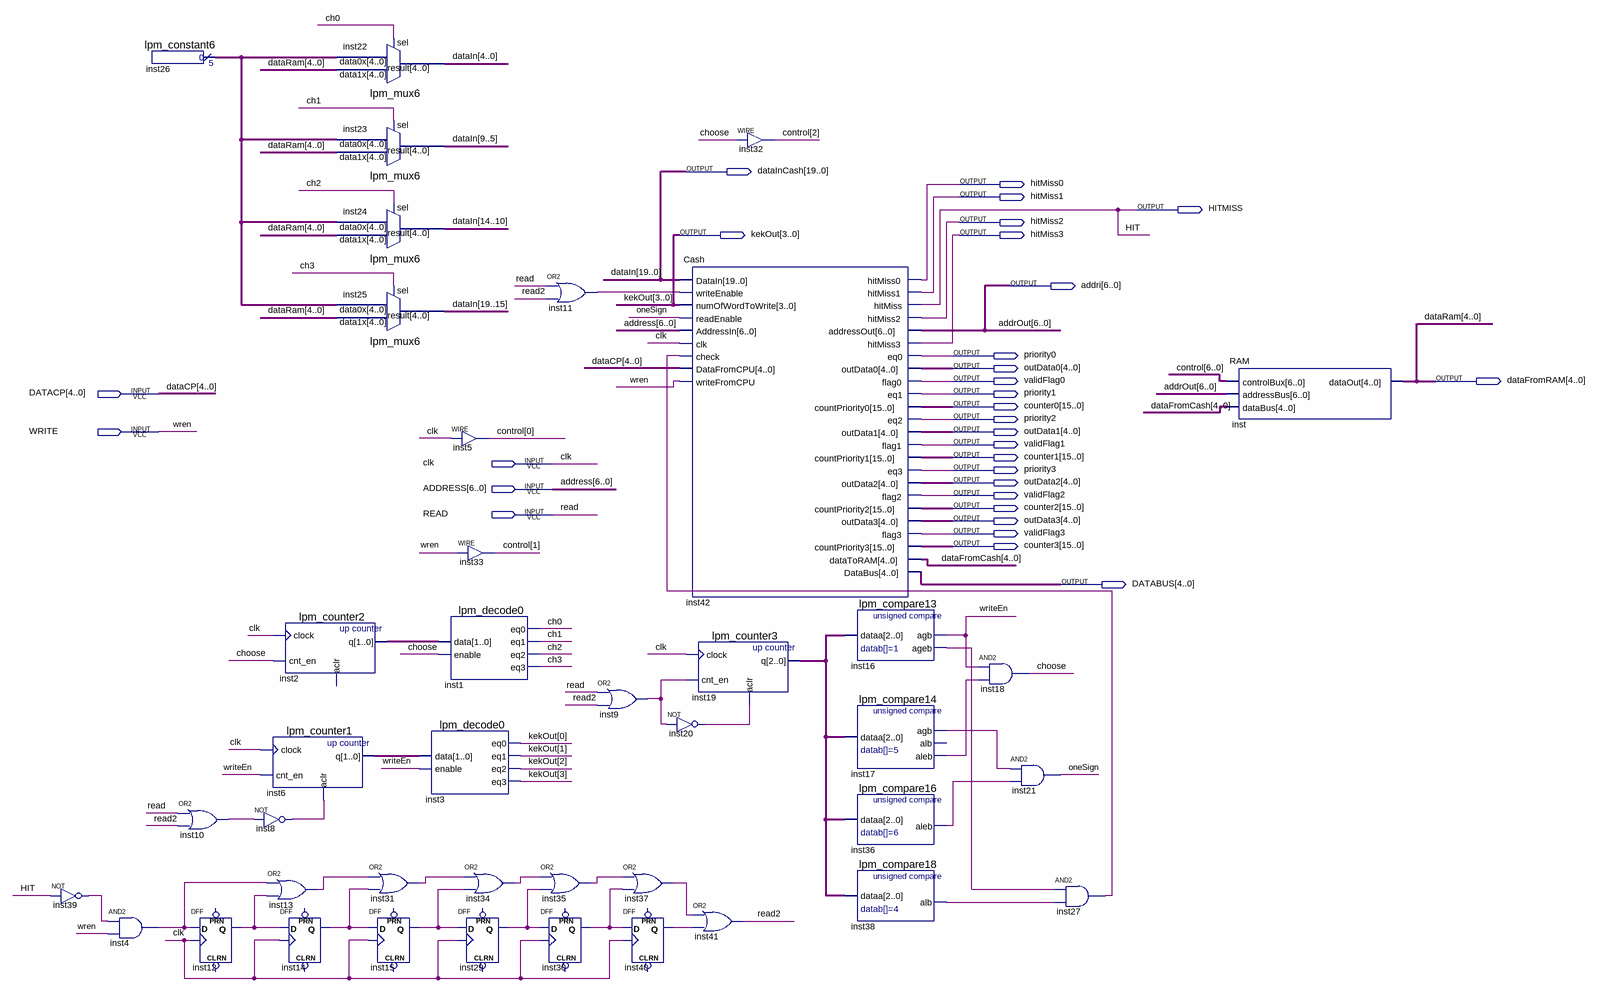
[diagram p0: schematic sheet]
// Quartus schematic laba6.bdf as structural Verilog: 41 symbols, 31 pins
module laba6 (
  input  [4:0] DATACP,
  input  WRITE,
  input  clk,
  input  [6:0] ADDRESS,
  input  READ,
  output [19:0] dataInCash,
  output hitMiss0,
  output hitMiss1,
  output HITMISS,
  output hitMiss2,
  output [3:0] kekOut,
  output hitMiss3,
  output [6:0] addri,
  output priority0,
  output [4:0] outData0,
  output validFlag0,
  output [4:0] dataFromRAM,
  output priority1,
  output [15:0] counter0,
  output priority2,
  output [4:0] outData1,
  output validFlag1,
  output [15:0] counter1,
  output priority3,
  output [4:0] outData2,
  output validFlag2,
  output [15:0] counter2,
  output [4:0] outData3,
  output validFlag3,
  output [15:0] counter3,
  output [4:0] DATABUS
);

  wire ch0, ch1, ch2, ch3, choose, inst4_out, inst8_out, inst9_out, inst10_out, inst11_out, inst12_q,
       inst13_out, inst14_q, inst15_q, inst16_ageb, inst17_agb, inst17_aleb, inst20_out, inst27_out,
       inst29_q, inst30_q, inst31_out, inst34_out, inst35_out, inst36_aleb, inst37_out, inst38_alb,
       inst39_out, inst40_q, oneSign, read2, writeEn;
  wire [1:0] inst2_q, inst6_q;
  wire [2:0] inst19_q;
  wire [4:0] dataFromCash, inst26_result;
  wire [6:0] control;

  not inst39 (inst39_out, HITMISS);
  and inst4 (inst4_out, inst39_out, WRITE);
  lpm_constant6 inst26 (.result(inst26_result));
  or inst10 (inst10_out, READ, read2);
  DFF inst12 (.CLK(clk), .D(inst4_out), .Q(inst12_q));  // open: CLRN, PRN
  lpm_counter2 inst2 (.clock(clk), .cnt_en(choose), .q(inst2_q));  // open: aclr
  lpm_counter1 inst6 (.clock(clk), .cnt_en(writeEn), .aclr(inst8_out), .q(inst6_q));
  not inst8 (inst8_out, inst10_out);
  or inst13 (inst13_out, inst4_out, inst12_q);
  DFF inst14 (.CLK(clk), .D(inst12_q), .Q(inst14_q));  // open: CLRN, PRN
  lpm_mux6 inst22 (.data1x(dataFromRAM), .data0x(inst26_result), .sel(ch0), .result(dataInCash[4:0]));
  lpm_mux6 inst23 (.data1x(dataFromRAM), .data0x(inst26_result), .sel(ch1), .result(dataInCash[9:5]));
  lpm_mux6 inst24 (.data1x(dataFromRAM), .data0x(inst26_result), .sel(ch2), .result(dataInCash[14:10]));
  lpm_mux6 inst25 (.data1x(dataFromRAM), .data0x(inst26_result), .sel(ch3), .result(dataInCash[19:15]));
  or inst31 (inst31_out, inst13_out, inst14_q);
  DFF inst15 (.CLK(clk), .D(inst14_q), .Q(inst15_q));  // open: CLRN, PRN
  lpm_decode0 inst1 (.data(inst2_q), .enable(choose), .eq0(ch0), .eq1(ch1), .eq2(ch2), .eq3(ch3));
  lpm_decode0 inst3 (
    .data(inst6_q), .enable(writeEn), .eq0(kekOut[0]), .eq1(kekOut[1]), .eq2(kekOut[2]), .eq3(kekOut[3]));
  assign control[0] = clk;  // WIRE inst5
  assign control[1] = WRITE;  // WIRE inst33
  or inst34 (inst34_out, inst31_out, inst15_q);
  DFF inst29 (.CLK(clk), .D(inst15_q), .Q(inst29_q));  // open: CLRN, PRN
  or inst35 (inst35_out, inst34_out, inst29_q);
  DFF inst30 (.CLK(clk), .D(inst29_q), .Q(inst30_q));  // open: CLRN, PRN
  or inst11 (inst11_out, READ, read2);
  or inst9 (inst9_out, READ, read2);
  or inst37 (inst37_out, inst35_out, inst30_q);
  DFF inst40 (.CLK(clk), .D(inst30_q), .Q(inst40_q));  // open: CLRN, PRN
  Cash inst42 (
    .DataIn(dataInCash), .writeEnable(inst11_out), .numOfWordToWrite(kekOut), .readEnable(oneSign),
    .AddressIn(ADDRESS), .clk(clk), .check(inst27_out), .DataFromCPU(DATACP), .writeFromCPU(WRITE),
    .hitMiss0(hitMiss0), .hitMiss1(hitMiss1), .hitMiss(HITMISS), .hitMiss2(hitMiss2), .addressOut(addri),
    .hitMiss3(hitMiss3), .eq0(priority0), .outData0(outData0), .flag0(validFlag0), .eq1(priority1),
    .countPriority0(counter0), .eq2(priority2), .outData1(outData1), .flag1(validFlag1),
    .countPriority1(counter1), .eq3(priority3), .outData2(outData2), .flag2(validFlag2),
    .countPriority2(counter2), .outData3(outData3), .flag3(validFlag3), .countPriority3(counter3),
    .dataToRAM(dataFromCash), .DataBus(DATABUS));
  lpm_counter3 inst19 (.clock(clk), .cnt_en(inst9_out), .aclr(inst20_out), .q(inst19_q));
  not inst20 (inst20_out, inst9_out);
  or inst41 (read2, inst37_out, inst40_q);
  assign control[2] = choose;  // WIRE inst32
  lpm_compare13 inst16 (.dataa(inst19_q), .agb(writeEn), .ageb(inst16_ageb));
  lpm_compare14 inst17 (.dataa(inst19_q), .agb(inst17_agb), .aleb(inst17_aleb));  // open: alb
  lpm_compare16 inst36 (.dataa(inst19_q), .aleb(inst36_aleb));
  lpm_compare18 inst38 (.dataa(inst19_q), .alb(inst38_alb));
  and inst18 (choose, writeEn, inst17_aleb);
  and inst21 (oneSign, inst17_agb, inst36_aleb);
  and inst27 (inst27_out, inst16_ageb, inst38_alb);
  RAM inst (.controlBux(control), .addressBus(addri), .dataBus(dataFromCash), .dataOut(dataFromRAM));

  // Other names for the same wires on the sheet: addrOut[6:0] = addri; dataIn[19:0] = dataInCash;
  //   dataRam[4:0] = dataFromRAM; HIT = HITMISS; wren = WRITE
endmodule
